# Altium project STM32WB5MMGH6TR.PrjPcb
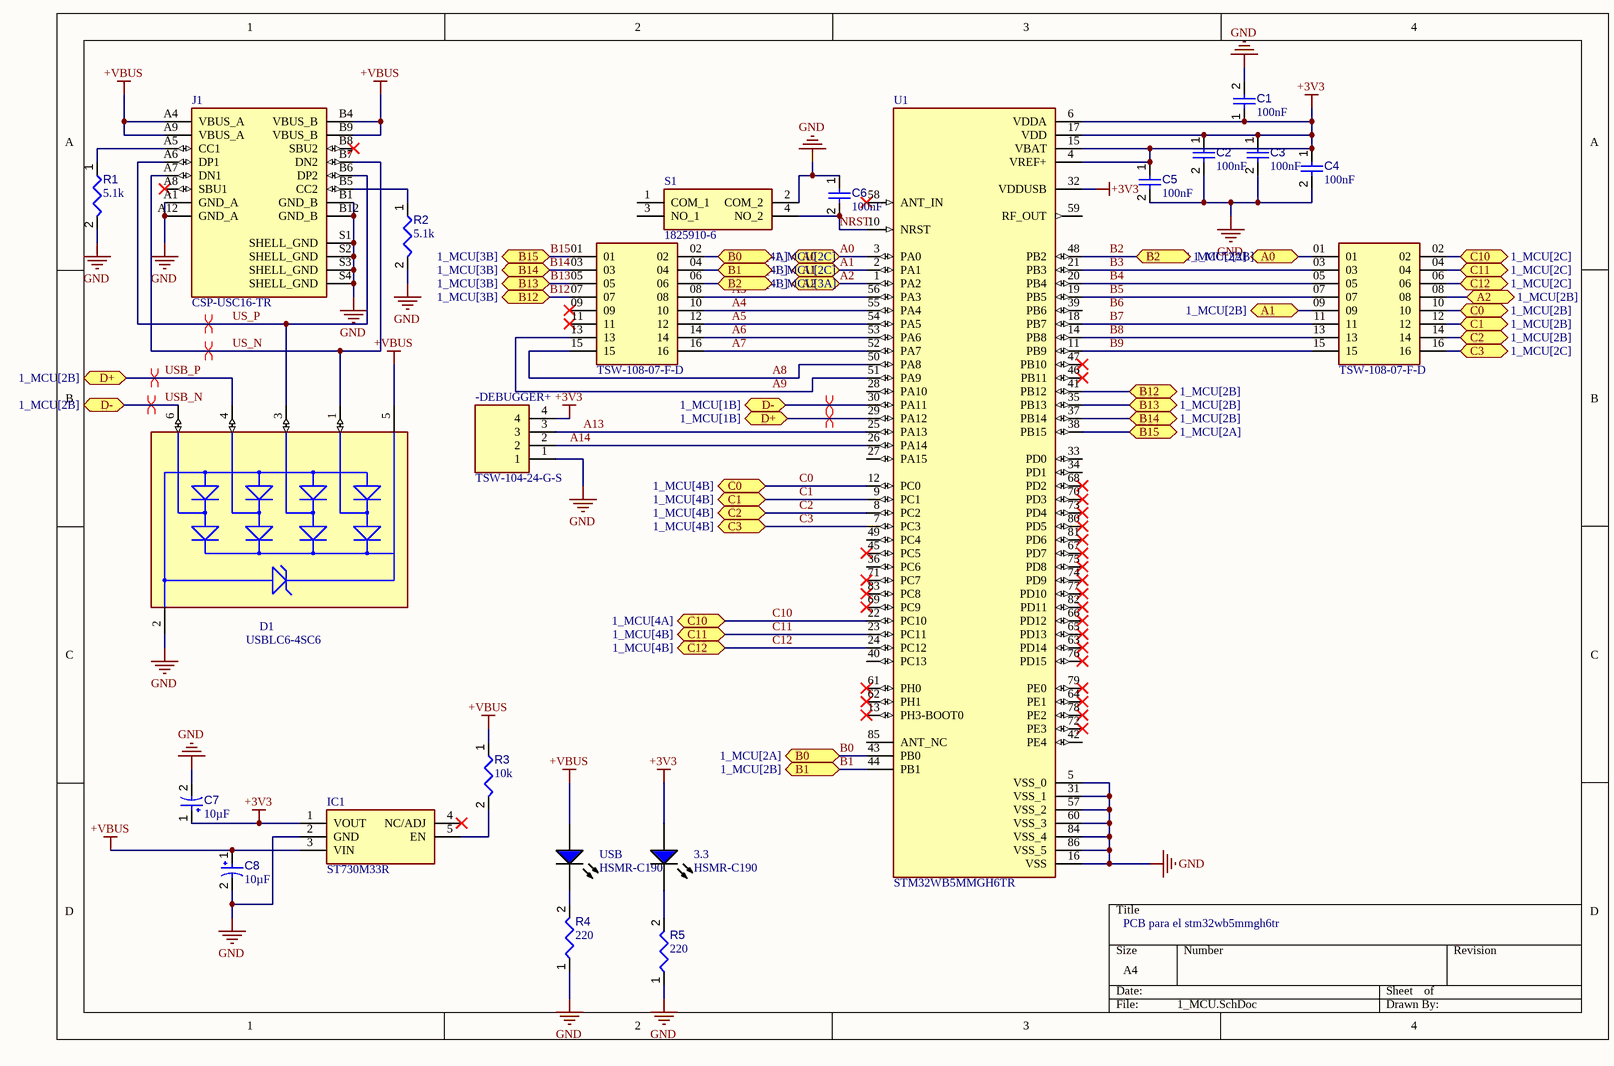
[diagram p0: 1_MCU.SchDoc]
3 sheets, 95 parts. Net scope: flat (ports and power ports of the same name join across sheets).
Board file: PCB.PcbDoc
Sheets:
  1_MCU.SchDoc
  2_Fuente.SchDoc
  3_ECG.SchDoc

## Sheet 1_MCU.SchDoc
size A4; SheetNumber: 1; SheetTotal: 3

### Parts
(Parts that share a designator on the sheet are numbered #1, #2 ... from top to bottom, then left to right.)
3.3  HSMR-C190  [AVAG-HSMX-C190_V]
-DEBUGGER+  TSW-104-24-G-S  [TSW-104-XX-YY-S]
?#1  TSW-108-07-F-D  [SAMTEC_TSW-108-07-F-D]
?#2  TSW-108-07-F-D  [SAMTEC_TSW-108-07-F-D]
C1  value 100nF  [CAPC1608X90X40NL10T20]  (hidden comment: Capacitor 100 nF +/-10% 50 V 0603)
C2  value 100nF  [CAPC1608X90X40NL10T20]  (hidden comment: Capacitor 100 nF +/-10% 50 V 0603)
C3  value 100nF  [CAPC1608X90X40NL10T20]  (hidden comment: Capacitor 100 nF +/-10% 50 V 0603)
C4  value 100nF  [CAPC1608X90X40NL10T20]  (hidden comment: Capacitor 100 nF +/-10% 50 V 0603)
C5  value 100nF  [CAPC1608X90X40NL10T20]  (hidden comment: Capacitor 100 nF +/-10% 50 V 0603)
C6  value 100nF  [CAPC1608X90X40NL10T20]  (hidden comment: Capacitor 100 nF +/-10% 50 V 0603)
C7  value 10µF  [CAPPR55-200-1100X500X1200]  (hidden comment: ECA1HM100)
C8  value 10µF  [CAPPR55-200-1100X500X1200]  (hidden comment: ECA1HM100)
D1  USBLC6-4SC6  [FP-SOT23-6L-MFG]
IC1  ST730M33R  [SOT95P280X145-5N]
J1  CSP-USC16-TR  [VALCON_CSP-USC16-TR]
R1  value 5.1k  [RESC1608X55X25ML10T15]  (hidden comment: Resistor 1k +/-1% 0603 100 5.1kmW)
R2  5.1k  [RESC1608X55X25ML10T15]
R3  10k  [RESC1608X55X25ML10T15]
R4  220  [RESC1608X55X25ML10T15]
R5  220  [RESC1608X55X25ML10T15]
S1  1825910-6  [18259106]
U1  STM32WB5MMGH6TR  [XCVR_STM32WB5MMGH6TR]
USB  HSMR-C190  [AVAG-HSMX-C190_V]

### Ports
A0 (bidir, see 1_MCU[2A]), A0 (bidir, see 1_MCU[4A]), A1 (bidir, see 1_MCU[2B]), A1 (bidir, see 1_MCU[4B]), A2 (bidir, see 1_MCU[2B]), A2 (bidir, see 1_MCU[4B]), B0 (bidir, see 1_MCU[2A]), B0 (bidir, see 1_MCU[2C]), B1 (bidir, see 1_MCU[2B]), B1 (bidir, see 1_MCU[2C]), B2 (bidir, see 1_MCU[2B]), B2 (bidir, see 1_MCU[3A]), B12 (bidir, see 1_MCU[2B]), B12 (bidir, see 1_MCU[3B]), B13 (bidir, see 1_MCU[2B]), B13 (bidir, see 1_MCU[3B]), B14 (bidir, see 1_MCU[2B]), B14 (bidir, see 1_MCU[3B]), B15 (bidir, see 1_MCU[2A]), B15 (bidir, see 1_MCU[3B]), C0 (bidir, see 1_MCU[2B]), C0 (bidir, see 1_MCU[4B]), C1 (bidir, see 1_MCU[2B]), C1 (bidir, see 1_MCU[4B]), C2 (bidir, see 1_MCU[2B]), C2 (bidir, see 1_MCU[4B]), C3 (bidir, see 1_MCU[2C]), C3 (bidir, see 1_MCU[4B]), C10 (bidir, see 1_MCU[2C]), C10 (bidir, see 1_MCU[4A]), C11 (bidir, see 1_MCU[2C]), C11 (bidir, see 1_MCU[4B]), C12 (bidir, see 1_MCU[2C]), C12 (bidir, see 1_MCU[4B]), D+ (bidir, see 1_MCU[1B]), D+ (bidir, see 1_MCU[2B]), D- (bidir, see 1_MCU[1B]), D- (bidir, see 1_MCU[2B])

### Nets
+3V3: 3.3.1(A) -DEBUGGER+.4 C1.1 C2.1 C3.1 C4.1 C5.1 C7.1 IC1.1(VOUT) U1.4(VREF+) U1.6(VDDA) U1.15(VBAT) U1.17(VDD) U1.32(VDDUSB)
+VBUS: C8.1 D1.5(VBUS) IC1.3(VIN) J1.A4(VBUS_A) J1.A9(VBUS_A) J1.B4(VBUS_B) J1.B9(VBUS_B) R3.1 USB.1(A)
GND: -DEBUGGER+.1 C1.2 C2.2 C3.2 C4.2 C5.2 C6.1 C7.2 C8.2 D1.2(GND) IC1.2(GND) J1.A1(GND_A) J1.A12(GND_A) J1.B1(GND_B) J1.B12(GND_B) J1.S1(SHELL_GND) J1.S2(SHELL_GND) J1.S3(SHELL_GND) J1.S4(SHELL_GND) R1.2 R2.2 R4.1 R5.1 S1.2(COM_2) U1.5(VSS_0) U1.16(VSS) U1.31(VSS_1) U1.57(VSS_2) U1.60(VSS_3) U1.84(VSS_4) U1.86(VSS_5)
A0: ?#2.01 U1.3(PA0) ; port A0
A1: ?#2.09 U1.2(PA1) ; port A1
A2: ?#2.08 U1.1(PA2) ; port A2
A3: ?#1.08 U1.56(PA3)
A4: ?#1.10 U1.55(PA4)
A5: ?#1.12 U1.54(PA5)
A6: ?#1.14 U1.53(PA6)
A7: ?#1.16 U1.52(PA7)
A8: ?#1.15 U1.50(PA8)
A9: ?#1.13 U1.51(PA9)
A13: -DEBUGGER+.3 U1.25(PA13)
A14: -DEBUGGER+.2 U1.26(PA14)
B0: ?#1.02 U1.43(PB0) ; port B0
B1: ?#1.04 U1.44(PB1) ; port B1
B2: ?#1.06 U1.48(PB2) ; port B2
B3: ?#2.03 U1.21(PB3)
B4: ?#2.05 U1.20(PB4)
B5: ?#2.07 U1.19(PB5)
B7: ?#2.11 U1.18(PB7)
B8: ?#2.13 U1.14(PB8)
B9: ?#2.15 U1.11(PB9)
B12: ?#1.07 U1.41(PB12) ; port B12
B13: ?#1.05 U1.35(PB13) ; port B13
B14: ?#1.03 U1.37(PB14) ; port B14
B15: ?#1.01 U1.38(PB15) ; port B15
C0: ?#2.10 U1.12(PC0) ; port C0
C1: ?#2.12 U1.9(PC1) ; port C1
C2: ?#2.14 U1.8(PC2) ; port C2
C3: ?#2.16 U1.7(PC3) ; port C3
C10: ?#2.02 U1.22(PC10) ; port C10
C11: ?#2.04 U1.23(PC11) ; port C11
C12: ?#2.06 U1.24(PC12) ; port C12
NRST: C6.2 S1.4(NO_2) U1.10(NRST)
US_N: D1.1(I/O1) J1.A7(DN1) J1.B7(DN2)
US_P: D1.3(I/O2) J1.A6(DP1) J1.B6(DP2)
USB_N: D1.6(I/O4) U1.30(PA11) ; port D-
USB_P: D1.4(I/O3) U1.29(PA12) ; port D+
Net3.3_2: 3.3.2(K) R5.2
NetIC1_5: IC1.5(EN) R3.2
NetJ1_A5: J1.A5(CC1) R1.1
NetJ1_B5: J1.B5(CC2) R2.1
NetR4_2: R4.2 USB.2(K)

Not connected (* = marked no-connect by the designer): ?#1 09* 11*; IC1 4(NC/ADJ)*; J1 A8(SBU1)* B8(SBU2)*; S1 1(COM_1) 3(NO_1); U1 13(PH3-BOOT0)* 27(PA15) 28(PA10) 33(PD0) 34(PD1) 36(PC6) 39(PB6) 40(PC13) 42(PE4) 45(PC5)* 46(PB11)* 47(PB10)* 49(PC4) 58(ANT_IN)* 59(RF_OUT) 61(PH0)* 62(PH1)* 63(PD14)* 64(PE1)* 65(PD13)* 66(PD12)* 67(PD7)* 68(PD2)* 69(PC9)* 70(PD3)* 71(PC7)* 72(PE3)* 73(PD4)* 74(PD9)* 75(PD8)* 76(PD15)* 77(PD10)* 78(PE2)* 79(PE0)* 80(PD5)* 81(PD6)* 82(PD11)* 83(PC8)* 85(ANT_NC)

### Layout directives
differential pair; differential pair class USB: US_N, US_P
differential pair: USB_N, USB_P

### Notes on the sheet
- PCB para el stm32wb5mmgh6tr
- Labels drawn without touching a wire or pin: B6

### Library data of the parts
3.3 USB = CMP-007-00015-2: LED Uni-Color Blue, 78 mW, 20 mA, -40 to 85 degC, 2-Pin SMD, RoHS, Tape and Reel; Manufacturer: Avago; Forward Voltage: 3.4V; Power: 78mW; Forward Current: 20mA; Luminous Intensity: 55mcd; Lens Style: Diffused; Viewing Angle: 155degrees; Pins: 2; Max Operating Temperature: 85°C; Colour: Blue; Datasheet Version: Apr-10; RoHS Compliant: True; Mounting Technology: SM; Min Operating Temperature: -40°C; Illumination Colour: Blue; Package Quantity: 4000; Datasheet URL: http://docs.avagotech.com/docs/AV02-0977EN; Package Reference: HSMX-C190; Packaging: TapeandReel; Nominal Vf: 3.4V; Case/Package: 0603; Package Description: 2-Pin Surface Mount Device, Body 1.6 x 0.8 mm, Height 0.9 mm; Manufacturer URL: http://www.avagotech.com/
-DEBUGGER+ = TSW-104-24-G-S: Connector; Manufacturer_Name: SAMTEC; Datasheet Link: http://suddendocs.samtec.com/prints/tsw-xxx-xx-xxx-x-xx-xxx-mkt.pdf; Manufacturer_Part_Number: TSW-104-24-G-S; Mouser Part Number: 200-TSW10424GS; Mouser Price/Stock: https://www.mouser.co.uk/ProductDetail/Samtec/TSW-104-24-G-S?qs=rU5fayqh%252BE0UmrmG73qvDg%3D%3D; Arrow Part Number: TSW-104-24-G-S; Arrow Price/Stock: https://www.arrow.com/en/products/tsw-104-24-g-s/samtec?region=europe
?#1 ?#2 = CMP-002-00072-1: MF: Samtec; Availability: Unavailable; Component Type: Standard; Value: *; Case/Package: None; Design Item ID: TSW-108-07-F-D; Pins: 16; Source: TSW-108-07-F-D.SchLib; Price: None; MP: TSW-108-07-F-D
C1-C6 = CMP-001-00017-6: Chip Capacitor, 100 nF, +/- 10%, 50 V, 0603 (1608 Metric); Voltage Rating: 50V; Capacitor Type: Ceramic; Tolerance: 10%; Mounting Technology: SM; Max Operating Temperature: 125°C; RoHS Compliant: True; Pins: 2; Case/Package: 0603; Min Operating Temperature: -55°C
C7 C8 = CMP-001-00025-7: Aluminum Electrolytic Capacitor, 10 uF, +/- 20%, 50 V, -40 to 85 degC, 2-Pin THD, RoHS, Bulk; Manufacturer: Panasonic; Ripple Current (AC): 65mA; Voltage Rating: 50V; Mounting Technology: TH; RoHS Compliant: True; Capacitor Type: Electrolytic; Datasheet Version: Rev. 05, 10/2016; Min Operating Temperature: -40°C; Packaging: Bulk; Ripple Current: 65mA; Tolerance: 20%; Max Operating Temperature: 85°C; Datasheet URL: https://industrial.panasonic.com/cdbs/www-data/pdf/RDF0000/ABA0000C1218.pdf; Lead Pitch: 2mm; Pins: 2; Diameter: 5mm; Manufacturer URL: http://www.panasonic.com/; Package Reference: CAPPR55-200-1100X500X1200; Package Description: 2-Pin Radial Lead, Dia 5 mm, Height 12 mm; Case/Package: Radial; Package Quantity: 200
D1 = CMP-2000-07370-2: TVS DIODE 5.25V 17V SOT23-6; Manufacturer: STMicroelectronics; Peak Pulse Power: 130W; Breakdown Voltage: 6V; Value: 3pF; Direction: Unidirectional; Interface: USB,Ethernet,Other; Number Of Channels: 4; Standoff Height: 0mm; Max Junction Temp: +125°C; Digikey Description: TVS DIODE 5.25V 17V SOT23-6; Automotive: No; Package: SOT23-6L; Mouser Description: USBLC6 Series 4 Line 6 V Uni / Bi-Directional ESD Protection - SOT-23-6; Octopart: https://octopart.com/usblc6-4sc6-stmicroelectronics-347147; RoHS: TRUE; ComponentLink2URL: https://upverter.com/datasheet/23dc4ffb028d868909e80577610284b194f13213.pdf; ComponentLink2Description: Datasheet; Device Class L1: Circuit Protection; Lead Free: Yes; Temperature Range High: +125°C; Device Class L2: ESD and Circuit Protection ICs; Device Class L3: unset; Capacitance: 3pF; Height: 1.45mm; Temperature Range Low: -40°C; Manufacturer Part Number: USBLC6-4SC6; Temperature: -40°C to +125°C; Category: Diode; Clamping Voltage: 17V
IC1 = ST730M33R: Integrated Circuit; Manufacturer_Name: STMicroelectronics; Datasheet Link: https://www.mouser.at/datasheet/2/389/st730-1621297.pdf; Height: 1.45mm; Manufacturer_Part_Number: ST730M33R; Mouser Part Number: 511-ST730M33R; Mouser Price/Stock: https://www.mouser.co.uk/ProductDetail/STMicroelectronics/ST730M33R?qs=GedFDFLaBXHUqSNzaYM2bg%3D%3D; Arrow Part Number: ST730M33R; Arrow Price/Stock: https://www.arrow.com/en/products/st730m33r/stmicroelectronics?region=nac
J1 = CMP-002-00071-1: CSP-USC16-TR Valcon USB Type C Surface Mount PCB Socket; Design Item ID: CSP-USC16-TR; Value: *; Source: CSP-USC16-TR.SchLib; Availability: In Stock; Pins: 20; Case/Package: None; Price: None; MF: Valcon; Component Type: Standard; Check_prices: https://www.snapeda.com/parts/CSP-USC16-TR/Valcon/view-part/?ref=eda; SnapEDA_Link: https://www.snapeda.com/parts/CSP-USC16-TR/Valcon/view-part/?ref=snap; Purchase-URL: https://pricing.snapeda.com/search/part/CSP-USC16-TR/?ref=eda; MP: CSP-USC16-TR
R1 R2 = CMP-009-00014-5: Chip Resistor, 1 KOhm, +/-1%, 0.1 W, -55 to 155 degC, 0603 (1608 Metric); Voltage Rating: 50V; Power: 100mW; Tolerance: 1%; Mounting Technology: SM; Pins: 2; Case/Package: 0603; Min Operating Temperature: -55°C; RoHS Compliant: True; Max Operating Temperature: 155°C
  R2: Value: 5.1k
R3-R5 = CMP-009-00017-5: Chip Resistor, 10 KOhm, +/- 1%, 01 W, -55 to 155 degC, 0603 (1608 Metric); Voltage Rating: 50V; Power: 100mW; RoHS Compliant: True; Min Operating Temperature: -55°C; Pins: 2; Case/Package: 0603; Mounting Technology: SM; Max Operating Temperature: 155°C; Tolerance: 1%
  R3: Value: 10k
  R4 R5: Value: 220
S1 = 1825910-6: Switch; Manufacturer_Name: TE Connectivity; Datasheet Link: https://www.te.com/commerce/DocumentDelivery/DDEController?Action=srchrtrv&DocNm=1825910&DocType=Customer+Drawing&DocLang=English&DocFormat=pdf&PartCntxt=1825910-6; Height: 5.3mm; Manufacturer_Part_Number: 1825910-6; Mouser Part Number: N/A; Mouser Price/Stock: https://www.mouser.co.uk/ProductDetail/TE-Connectivity/1825910-6?qs=A6cQTCBcXncisYDS1KbpGA%3D%3D; Arrow Part Number: 1825910-6; Arrow Price/Stock: https://www.arrow.com/en/products/1825910-6/te-connectivity?region=europe
U1 = CMP-003-000000-1: 802.15.4ï¼Œ è“ç‰™è“ç‰™ v5.0ï¼Œ çº¿ç¨‹ï¼Œ ZigbeeÂ® æ”¶å‘æ¨¡å— 2.4GHz é›†æˆï¼Œ èŠ¯ç‰‡è¡¨é¢è´´è£…; MF: STMicroelectronics; Pin Count: 86; Check_prices: https://www.snapeda.com/parts/STM32WB5MMGH6TR/STMicroelectronics/view-part/?ref=eda; Design Item ID: STM32WB5MMGH6TR; Availability: In Stock; Value: *; SnapEDA_Link: https://www.snapeda.com/parts/STM32WB5MMGH6TR/STMicroelectronics/view-part/?ref=snap; Purchase-URL: https://pricing.snapeda.com/search/part/STM32WB5MMGH6TR/?ref=eda; Price: None; MP: STM32WB5MMGH6TR; Source: STM32WB5MMGH6TR.SchLib; Package: LFLGA-86 STMicroelectronics; Component Type: Standard

## Sheet 2_Fuente.SchDoc
size A4; SheetNumber: 2; SheetTotal: 3
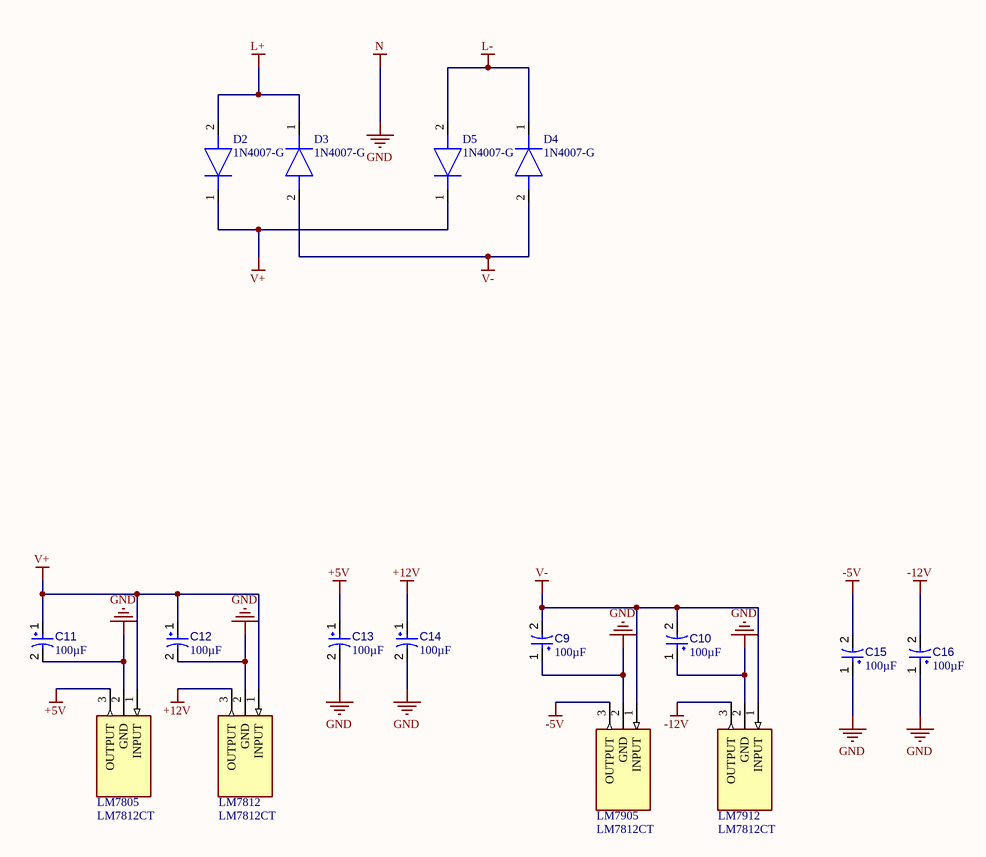
[diagram p1: 2_Fuente.SchDoc]

### Parts
C9  value 100µF  [CAPPR55-200-1100X500X1200]  (hidden comment: ECA1HM100)
C10  value 100µF  [CAPPR55-200-1100X500X1200]  (hidden comment: ECA1HM100)
C11  value 100µF  [CAPPR55-200-1100X500X1200]  (hidden comment: ECA1HM100)
C12  value 100µF  [CAPPR55-200-1100X500X1200]  (hidden comment: ECA1HM100)
C13  value 100µF  [CAPPR55-200-1100X500X1200]  (hidden comment: ECA1HM100)
C14  value 100µF  [CAPPR55-200-1100X500X1200]  (hidden comment: ECA1HM100)
C15  value 100µF  [CAPPR55-200-1100X500X1200]  (hidden comment: ECA1HM100)
C16  value 100µF  [CAPPR55-200-1100X500X1200]  (hidden comment: ECA1HM100)
D2  1N4007-G  [DIOAD1410W90L470D235]
D3  1N4007-G  [DIOAD1410W90L470D235]
D4  1N4007-G  [DIOAD1410W90L470D235]
D5  1N4007-G  [DIOAD1410W90L470D235]
LM7805  LM7812CT  [TO254P470X1028X1955-3P]
LM7812  LM7812CT  [TO254P470X1028X1955-3P]
LM7905  LM7812CT  [TO254P470X1028X1955-3P]
LM7912  LM7812CT  [TO254P470X1028X1955-3P]

### Nets
+5V: C13.1 LM7805.3(OUTPUT)
+12V: C14.1 LM7812.3(OUTPUT)
-5V: C15.2 LM7905.3(OUTPUT)
-12V: C16.2 LM7912.3(OUTPUT)
GND: C9.1 C10.1 C11.2 C12.2 C13.2 C14.2 C15.1 C16.1 LM7805.2(GND) LM7812.2(GND) LM7905.2(GND) LM7912.2(GND)  [also labelled N]
L+: D2.2(A) D3.1(K)
L-: D4.1(K) D5.2(A)
V+: C11.1 C12.1 D2.1(K) D5.1(K) LM7805.1(INPUT) LM7812.1(INPUT)
V-: C9.2 C10.2 D3.2(A) D4.2(A) LM7905.1(INPUT) LM7912.1(INPUT)

### Library data of the parts
C9-C16 = CMP-001-00025-7: as C7 on sheet 1_MCU; Mounting Technology: TH; RoHS Compliant: True; Capacitor Type: Electrolytic; Datasheet Version: Rev. 05, 10/2016; Min Operating Temperature: -40°C; Packaging: Bulk; Ripple Current: 65mA; Tolerance: 20%; Max Operating Temperature: 85°C; Datasheet URL: https://industrial.panasonic.com/cdbs/www-data/pdf/RDF0000/ABA0000C1218.pdf; Lead Pitch: 2mm; Pins: 2; Diameter: 5mm; Manufacturer URL: http://www.panasonic.com/; Package Reference: CAPPR55-200-1100X500X1200; Package Description: 2-Pin Radial Lead, Dia 5 mm, Height 12 mm; Case/Package: Radial; Package Quantity: 200
D2-D5 = 1N4007-G: Diode; Manufacturer_Name: Comchip Technology; Datasheet Link: https://datasheet.datasheetarchive.com/originals/distributors/Datasheets-DGA23/1390217.pdf; Manufacturer_Part_Number: 1N4007-G; Mouser Part Number: 750-1N4007-G; Mouser Price/Stock: https://www.mouser.co.uk/ProductDetail/Comchip-Technology/1N4007-G?qs=2qJf6qQ4IOKzApuByvlhjQ%3D%3D; Arrow Part Number: 1N4007-G; Arrow Price/Stock: https://www.arrow.com/en/products/1n4007-g/comchip-technology?region=nac
LM7805 LM7812 LM7905 LM7912 = LM7812CT: Integrated Circuit; Manufacturer_Name: Texas Instruments; Datasheet Link: http://www.ti.com/lit/ds/symlink/lm7800.pdf; Height: 4.7mm; Manufacturer_Part_Number: LM7812CT; Mouser Part Number: 926-LM7812CT; Mouser Price/Stock: https://www.mouser.co.uk/ProductDetail/Texas-Instruments/LM7812CT?qs=QbsRYf82W3EQj7KGft8TFg%3D%3D

## Sheet 3_ECG.SchDoc
size A4; SheetNumber: 3; SheetTotal: 3
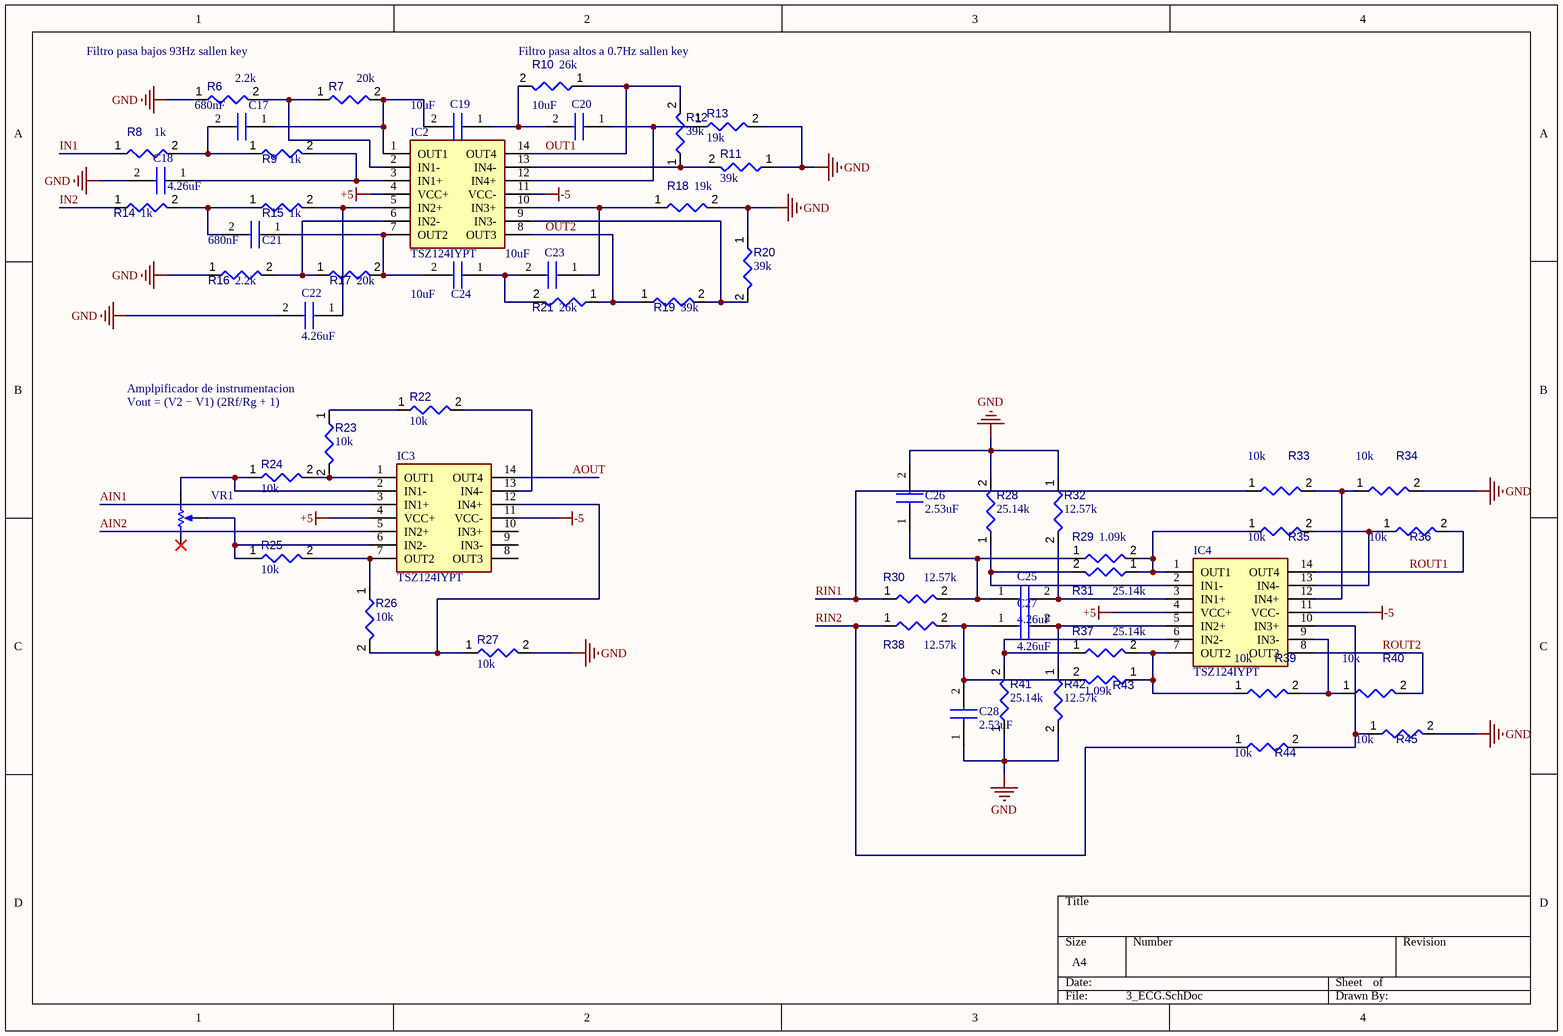
[diagram p2: 3_ECG.SchDoc]

### Parts
C17  680nF  [C322C104K1R5TA]
C18  4.26uF  [C322C104K1R5TA]
C19  10uF  [C322C104K1R5TA]
C20  10uF  [C322C104K1R5TA]
C21  680nF  [C322C104K1R5TA]
C22  4.26uF  [C322C104K1R5TA]
C23  10uF  [C322C104K1R5TA]
C24  10uF  [C322C104K1R5TA]
C25  4.26uF  [C322C104K1R5TA]
C26  2.53uF  [C322C104K1R5TA]
C27  4.26uF  [C322C104K1R5TA]
C28  2.53uF  [C322C104K1R5TA]
IC2  TSZ124IYPT  [SOP65P640X120-14N]
IC3  TSZ124IYPT  [SOP65P640X120-14N]
IC4  TSZ124IYPT  [SOP65P640X120-14N]
R6  2.2k  [RESC1608X55X25ML10T15]
R7  20k  [RESC1608X55X25ML10T15]
R8  1k  [RESC1608X55X25ML10T15]
R9  1k  [RESC1608X55X25ML10T15]
R10  value 26k  [RESC1608X55X25ML10T15]  (hidden comment: 16k)
R11  39k  [RESC1608X55X25ML10T15]
R12  39k  [RESC1608X55X25ML10T15]
R13  19k  [RESC1608X55X25ML10T15]
R14  1k  [RESC1608X55X25ML10T15]
R15  1k  [RESC1608X55X25ML10T15]
R16  2.2k  [RESC1608X55X25ML10T15]
R17  20k  [RESC1608X55X25ML10T15]
R18  19k  [RESC1608X55X25ML10T15]
R19  39k  [RESC1608X55X25ML10T15]
R20  39k  [RESC1608X55X25ML10T15]
R21  26k  [RESC1608X55X25ML10T15]
R22  10k  [RESC1608X55X25ML10T15]
R23  10k  [RESC1608X55X25ML10T15]
R24  10k  [RESC1608X55X25ML10T15]
R25  10k  [RESC1608X55X25ML10T15]
R26  10k  [RESC1608X55X25ML10T15]
R27  10k  [RESC1608X55X25ML10T15]
R28  25.14k  [RESC1608X55X25ML10T15]
R29  value 1.09k  [RESC1608X55X25ML10T15]  (hidden comment: 1k)
R30  value 12.57k  [RESC1608X55X25ML10T15]  (hidden comment: 12.5k)
R31  25.14k  [RESC1608X55X25ML10T15]
R32  12.57k  [RESC1608X55X25ML10T15]
R33  10k  [RESC1608X55X25ML10T15]
R34  10k  [RESC1608X55X25ML10T15]
R35  10k  [RESC1608X55X25ML10T15]
R36  10k  [RESC1608X55X25ML10T15]
R37  25.14k  [RESC1608X55X25ML10T15]
R38  12.57k  [RESC1608X55X25ML10T15]
R39  10k  [RESC1608X55X25ML10T15]
R40  10k  [RESC1608X55X25ML10T15]
R41  25.14k  [RESC1608X55X25ML10T15]
R42  12.57k  [RESC1608X55X25ML10T15]
R43  value 1.09k  [RESC1608X55X25ML10T15]  (hidden comment: 1k)
R44  10k  [RESC1608X55X25ML10T15]
R45  10k  [RESC1608X55X25ML10T15]
VR1  3296W-1-103LF  [BOUR-3296W]  (value not drawn)

### Nets
+5: IC2.4(VCC+) IC3.4(VCC+) IC4.4(VCC+)
-5: IC2.11(VCC-) IC3.11(VCC-) IC4.11(VCC-)
GND: C18.2(-) C22.2(-) C26.2(-) C28.1(+) R6.1 R11.1 R13.2 R16.1 R18.2 R20.1 R27.2 R28.2 R32.1 R34.2 R41.1 R42.2 R45.2
AIN1: IC3.3(IN1+)
AIN2: IC3.5(IN2+)
AOUT: IC3.14(OUT4)
IN1: R8.1
IN2: R14.1
OUT1: IC2.14(OUT4) R10.1 R12.2
OUT2: IC2.8(OUT3) R19.1 R21.1
RIN1: R30.1 R33.1
RIN2: R38.1 R44.1
ROUT1: IC4.14(OUT4) R36.2
ROUT2: IC4.8(OUT3) R40.2
NetC17_1: C17.1(+) C19.2(-) IC2.1(OUT1) R7.2
NetC17_2: C17.2(-) R8.2 R9.1
NetC18_1: C18.1(+) IC2.3(IN1+) R9.2
NetC19_1: C19.1(+) C20.2(-) R10.2
NetC20_1: C20.1(+) IC2.12(IN4+) R13.1
NetC21_1: C21.1(+) C24.2(-) IC2.7(OUT2) R17.2
NetC21_2: C21.2(-) R14.2 R15.1
NetC22_1: C22.1(+) IC2.5(IN2+) R15.2
NetC23_1: C23.1(+) IC2.10(IN3+) R18.1
NetC23_2: C23.2(-) C24.1(+) R21.2
NetC25_1: C25.1(+) C26.1(+) R29.1 R30.2
NetC25_2: C25.2(-) IC4.3(IN1+) R32.2
NetC27_1: C27.1(+) C28.2(-) R38.2 R43.2
NetC27_2: C27.2(-) IC4.5(IN2+) R42.1
NetIC2_2: IC2.2(IN1-) R6.2 R7.1
NetIC2_6: IC2.6(IN2-) R16.2 R17.1
NetIC2_9: IC2.9(IN3-) R19.2 R20.2
NetIC2_13: IC2.13(IN4-) R11.2 R12.1
NetIC3_1: IC3.1(OUT1) R23.2 R24.2
NetIC3_2: IC3.2(IN1-) R24.1 VR1.3(CW)
NetIC3_6: IC3.6(IN2-) R25.1 VR1.2(S)
NetIC3_7: IC3.7(OUT2) R25.2 R26.1
NetIC3_12: IC3.12(IN4+) R26.2 R27.1
NetIC3_13: IC3.13(IN4-) R22.2
NetIC4_1: IC4.1(OUT1) R29.2 R31.1 R35.1
NetIC4_2: IC4.2(IN1-) R28.1 R31.2
NetIC4_6: IC4.6(IN2-) R37.1 R41.2
NetIC4_7: IC4.7(OUT2) R37.2 R39.1 R43.1
NetIC4_9: IC4.9(IN3-) R39.2 R40.1
NetIC4_10: IC4.10(IN3+) R44.2 R45.1
NetIC4_12: IC4.12(IN4+) R33.2 R34.1
NetIC4_13: IC4.13(IN4-) R35.2 R36.1
NetR22_1: R22.1 R23.1

Not connected (* = marked no-connect by the designer): IC3 8(OUT3) 9(IN3-) 10(IN3+); VR1 1(CCW)*

### Notes on the sheet
- Filtro pasa bajos 93Hz sallen key
- (near R10) Filtro pasa altos a 0.7Hz sallen key
- (near R23) Amplpificador de instrumentacion
- (near R23) Vout = (V2 − V1) (2Rf/Rg + 1)

### Library data of the parts
C17-C28 = C322C104M5U5TA: Capacitor; Manufacturer_Name: KEMET; Datasheet Link: https://content.kemet.com/datasheets/KEM_C1051_GOLDMAX_Z5U.pdf; Height: 6.6mm; Manufacturer_Part_Number: C322C104M5U5TA; Mouser Part Number: 80-C322C104M5U; Mouser Price/Stock: https://www.mouser.co.uk/ProductDetail/KEMET/C322C104M5U5TA?qs=CDCeLP2tGBsLrnt3J6Fqow%3D%3D; Arrow Part Number: C322C104M5U5TA; Arrow Price/Stock: https://www.arrow.com/en/products/c322c104m5u5ta/kemet-corporation
IC2-IC4 = TSZ124IYPT: Integrated Circuit; Manufacturer_Name: STMicroelectronics; Datasheet Link: https://mouser.componentsearchengine.com/Datasheets/1/TSZ124IYPT.pdf; Height: 1.2mm; Manufacturer_Part_Number: TSZ124IYPT; Mouser Part Number: 511-TSZ124IYPT; Mouser Price/Stock: https://www.mouser.co.uk/ProductDetail/STMicroelectronics/TSZ124IYPT?qs=4ccVDqXDOrmRxbJcRtShKQ%3D%3D; Arrow Part Number: TSZ124IYPT; Arrow Price/Stock: https://www.arrow.com/en/products/tsz124iypt/stmicroelectronics?region=nac
R6-R20 R29-R45 = CMP-009-00017-5: as R3 on sheet 1_MCU; RoHS Compliant: True; Min Operating Temperature: -55°C; Pins: 2; Case/Package: 0603; Mounting Technology: SM; Max Operating Temperature: 155°C; Tolerance: 1%
  R6 R16: Value: 2.2k
  R7 R17: Value: 20k
  R8 R9 R14 R15: Value: 1k
  R11 R12 R19 R20: Value: 39k
  R13 R18: Value: 19k
  R31 R37 R41: Value: 25.14k
  R32 R38 R42: Value: 12.57k
  R33-R36 R39 R40 R44 R45: Value: 10k
R21 R28 = CMP-009-00017-5: Voltage Rating: 50V; Power: 100mW; Tolerance: 1%; RoHS Compliant: True; Min Operating Temperature: -55°C; Pins: 2; Case/Package: 0603; Mounting Technology: SM; Max Operating Temperature: 155°C
  R21: Value: 26k
  R28: Value: 25.14k
R22-R27 = CMP-009-00014-5: as R1 on sheet 1_MCU; Mounting Technology: SM; Pins: 2; Case/Package: 0603; Min Operating Temperature: -55°C; RoHS Compliant: True; Max Operating Temperature: 155°C; Value: 10k
VR1 = CMP-009-00038-2: Square Trimpot(R) Trimming Potentiometer, 10 KOhm, +/- 10%, 0.5 W, -55 to 125 degC, 3-Pin THD, RoHS, Tube; Manufacturer: Bourns; Voltage Rating: 300V; Power: 500mW; Resistance: 10k; Tolerance: 10%; Min Operating Temperature: -55°C; Case/Package: 3296W; Max Operating Temperature: 150°C; Package Reference: 3296W; Mounting Technology: TH; Manufacturer URL: http://www.bourns.com/; Package Quantity: 50; Package Description: 3-Pin Through Hole Device, Body 9.53 x 4.83 mm, Pitch 2.54 mm; Packaging: Rail/Tube; Datasheet URL: http://www.bourns.com/docs/Product-Datasheets/3296.pdf; RoHS Compliant: True; Datasheet Version: May-16

## Nets that join several sheets
GND: 1_MCU (31 pins), 2_Fuente (12 pins), 3_ECG (17 pins)